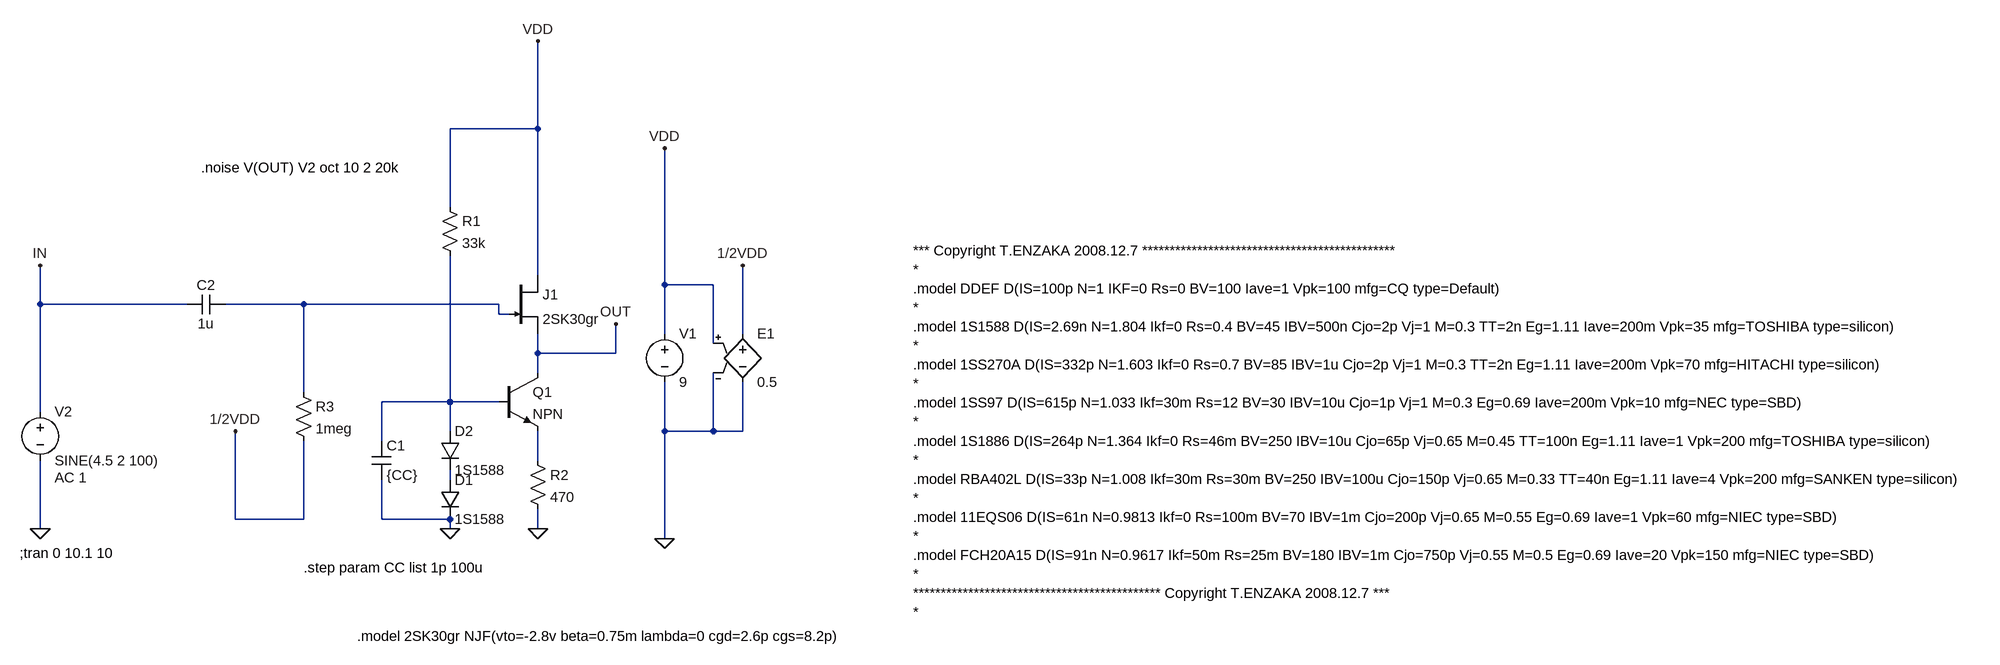
[diagram p0: schematic FET_buffer_ActiveLoad.asc]
FET_buffer_ActiveLoad.asc, the LTspice schematic file:
Version 4
SHEET 1 3324 680
WIRE 688 -368 688 -512
WIRE 688 -368 544 -368
WIRE 544 -240 544 -368
WIRE 688 -128 688 -368
WIRE 896 -112 896 -336
WIRE 976 -112 896 -112
WIRE -128 -80 -128 -144
WIRE 112 -80 -128 -80
WIRE 304 -80 176 -80
WIRE 624 -80 304 -80
WIRE 624 -64 624 -80
WIRE 640 -64 624 -64
WIRE 896 -32 896 -112
WIRE 1024 -32 1024 -144
WIRE 976 -16 976 -112
WIRE 688 0 688 -32
WIRE 816 0 816 -48
WIRE 816 0 688 0
WIRE 688 32 688 0
WIRE 304 64 304 -80
WIRE 544 80 544 -160
WIRE 544 80 432 80
WIRE 624 80 544 80
WIRE -128 96 -128 -80
WIRE 544 128 544 80
WIRE 896 128 896 48
WIRE 976 128 976 32
WIRE 976 128 896 128
WIRE 1024 128 1024 48
WIRE 1024 128 976 128
WIRE 432 144 432 80
WIRE 688 176 688 128
WIRE 544 208 544 192
WIRE 192 272 192 128
WIRE 304 272 304 144
WIRE 304 272 192 272
WIRE 432 272 432 208
WIRE 544 272 432 272
WIRE -128 288 -128 176
WIRE 544 288 544 272
WIRE 688 288 688 256
WIRE 896 304 896 128
FLAG -128 288 0
FLAG 688 288 0
FLAG 544 288 0
FLAG 896 304 0
FLAG 896 -336 VDD
FLAG 1024 -144 1/2VDD
FLAG 816 -48 OUT
FLAG -128 -144 IN
FLAG 688 -512 VDD
FLAG 192 128 1/2VDD
SYMBOL res 528 -256 R0
SYMATTR InstName R1
SYMATTR Value 33k
SYMBOL diode 528 208 R0
SYMATTR InstName D1
SYMATTR Value 1S1588
SYMBOL diode 528 128 R0
SYMATTR InstName D2
SYMATTR Value 1S1588
SYMBOL npn 624 32 R0
SYMATTR InstName Q1
SYMBOL res 672 160 R0
SYMATTR InstName R2
SYMATTR Value 470
SYMBOL voltage 896 -48 R0
WINDOW 123 0 0 Left 2
WINDOW 39 0 0 Left 2
SYMATTR InstName V1
SYMATTR Value 9
SYMBOL e 1024 -48 R0
SYMATTR InstName E1
SYMATTR Value 0.5
SYMBOL cap 416 144 R0
SYMATTR InstName C1
SYMATTR Value {CC}
SYMBOL voltage -128 80 R0
WINDOW 123 24 124 Left 2
WINDOW 39 0 0 Left 2
SYMATTR InstName V2
SYMATTR Value SINE(4.5 2 100)
SYMATTR Value2 AC 1
SYMBOL cap 176 -96 R90
WINDOW 0 0 32 VBottom 2
WINDOW 3 32 32 VTop 2
SYMATTR InstName C2
SYMATTR Value 1u
SYMBOL res 288 48 R0
SYMATTR InstName R3
SYMATTR Value 1meg
SYMBOL njf 640 -128 R0
SYMATTR InstName J1
SYMATTR Value 2SK30gr
TEXT -162 328 Left 2 !;tran 0 10.1 10
TEXT 392 464 Left 2 !.model 2SK30gr NJF(vto=-2.8v beta=0.75m lambda=0 cgd=2.6p cgs=8.2p)
TEXT 1304 -168 Left 2 !*** Copyright T.ENZAKA 2008.12.7 **********************************************\n*\n.model DDEF D(IS=100p N=1 IKF=0 Rs=0 BV=100 Iave=1 Vpk=100 mfg=CQ type=Default)\n*\n.model 1S1588 D(IS=2.69n N=1.804 Ikf=0 Rs=0.4 BV=45 IBV=500n Cjo=2p Vj=1 M=0.3 TT=2n Eg=1.11 Iave=200m Vpk=35 mfg=TOSHIBA type=silicon)\n*\n.model 1SS270A D(IS=332p N=1.603 Ikf=0 Rs=0.7 BV=85 IBV=1u Cjo=2p Vj=1 M=0.3 TT=2n Eg=1.11 Iave=200m Vpk=70 mfg=HITACHI type=silicon)\n*\n.model 1SS97 D(IS=615p N=1.033 Ikf=30m Rs=12 BV=30 IBV=10u Cjo=1p Vj=1 M=0.3 Eg=0.69 Iave=200m Vpk=10 mfg=NEC type=SBD)\n*\n.model 1S1886 D(IS=264p N=1.364 Ikf=0 Rs=46m BV=250 IBV=10u Cjo=65p Vj=0.65 M=0.45 TT=100n Eg=1.11 Iave=1 Vpk=200 mfg=TOSHIBA type=silicon)\n*\n.model RBA402L D(IS=33p N=1.008 Ikf=30m Rs=30m BV=250 IBV=100u Cjo=150p Vj=0.65 M=0.33 TT=40n Eg=1.11 Iave=4 Vpk=200 mfg=SANKEN type=silicon)\n*\n.model 11EQS06 D(IS=61n N=0.9813 Ikf=0 Rs=100m BV=70 IBV=1m Cjo=200p Vj=0.65 M=0.55 Eg=0.69 Iave=1 Vpk=60 mfg=NIEC type=SBD)\n*\n.model FCH20A15 D(IS=91n N=0.9617 Ikf=50m Rs=25m BV=180 IBV=1m Cjo=750p Vj=0.55 M=0.5 Eg=0.69 Iave=20 Vpk=150 mfg=NIEC type=SBD)\n*\n********************************************* Copyright T.ENZAKA 2008.12.7 ***\n*
TEXT 136 -304 Left 2 !.noise V(OUT) V2 oct 10 2 20k
TEXT 304 352 Left 2 !.step param CC list 1p 100u

The netlist it stands for:
* FET_buffer_ActiveLoad.asc
R1 VDD N002 33k
D1 N004 0 1S1588
D2 N002 N004 1S1588
Q1 OUT N002 N003 0 NPN
R2 N003 0 470
V1 VDD 0 9
E1 1/2VDD 0 VDD 0 0.5
C1 N002 0 {CC}
V2 IN 0 SINE(4.5 2 100) AC 1
C2 N001 IN 1u
R3 N001 1/2VDD 1meg
J1 VDD N001 OUT 2SK30gr
.model D D
.lib standard.dio
.model NPN NPN
.model PNP PNP
.lib standard.bjt
.model NJF NJF
.model PJF PJF
.lib standard.jft
;tran 0 10.1 10
.model 2SK30gr NJF(vto=-2.8v beta=0.75m lambda=0 cgd=2.6p cgs=8.2p)
*** Copyright T.ENZAKA 2008.12.7 **********************************************
*
.model DDEF D(IS=100p N=1 IKF=0 Rs=0 BV=100 Iave=1 Vpk=100 mfg=CQ type=Default)
*
.model 1S1588 D(IS=2.69n N=1.804 Ikf=0 Rs=0.4 BV=45 IBV=500n Cjo=2p Vj=1 M=0.3 TT=2n Eg=1.11 Iave=200m Vpk=35 mfg=TOSHIBA type=silicon)
*
.model 1SS270A D(IS=332p N=1.603 Ikf=0 Rs=0.7 BV=85 IBV=1u Cjo=2p Vj=1 M=0.3 TT=2n Eg=1.11 Iave=200m Vpk=70 mfg=HITACHI type=silicon)
*
.model 1SS97 D(IS=615p N=1.033 Ikf=30m Rs=12 BV=30 IBV=10u Cjo=1p Vj=1 M=0.3 Eg=0.69 Iave=200m Vpk=10 mfg=NEC type=SBD)
*
.model 1S1886 D(IS=264p N=1.364 Ikf=0 Rs=46m BV=250 IBV=10u Cjo=65p Vj=0.65 M=0.45 TT=100n Eg=1.11 Iave=1 Vpk=200 mfg=TOSHIBA type=silicon)
*
.model RBA402L D(IS=33p N=1.008 Ikf=30m Rs=30m BV=250 IBV=100u Cjo=150p Vj=0.65 M=0.33 TT=40n Eg=1.11 Iave=4 Vpk=200 mfg=SANKEN type=silicon)
*
.model 11EQS06 D(IS=61n N=0.9813 Ikf=0 Rs=100m BV=70 IBV=1m Cjo=200p Vj=0.65 M=0.55 Eg=0.69 Iave=1 Vpk=60 mfg=NIEC type=SBD)
*
.model FCH20A15 D(IS=91n N=0.9617 Ikf=50m Rs=25m BV=180 IBV=1m Cjo=750p Vj=0.55 M=0.5 Eg=0.69 Iave=20 Vpk=150 mfg=NIEC type=SBD)
*
********************************************* Copyright T.ENZAKA 2008.12.7 ***
*
.noise V(OUT) V2 oct 10 2 20k
.step param CC list 1p 100u
.backanno
.end